# EAGLE design mainboard (EAGLE 9.6.2)
CNAME: Line Follower; CREVISION: 1
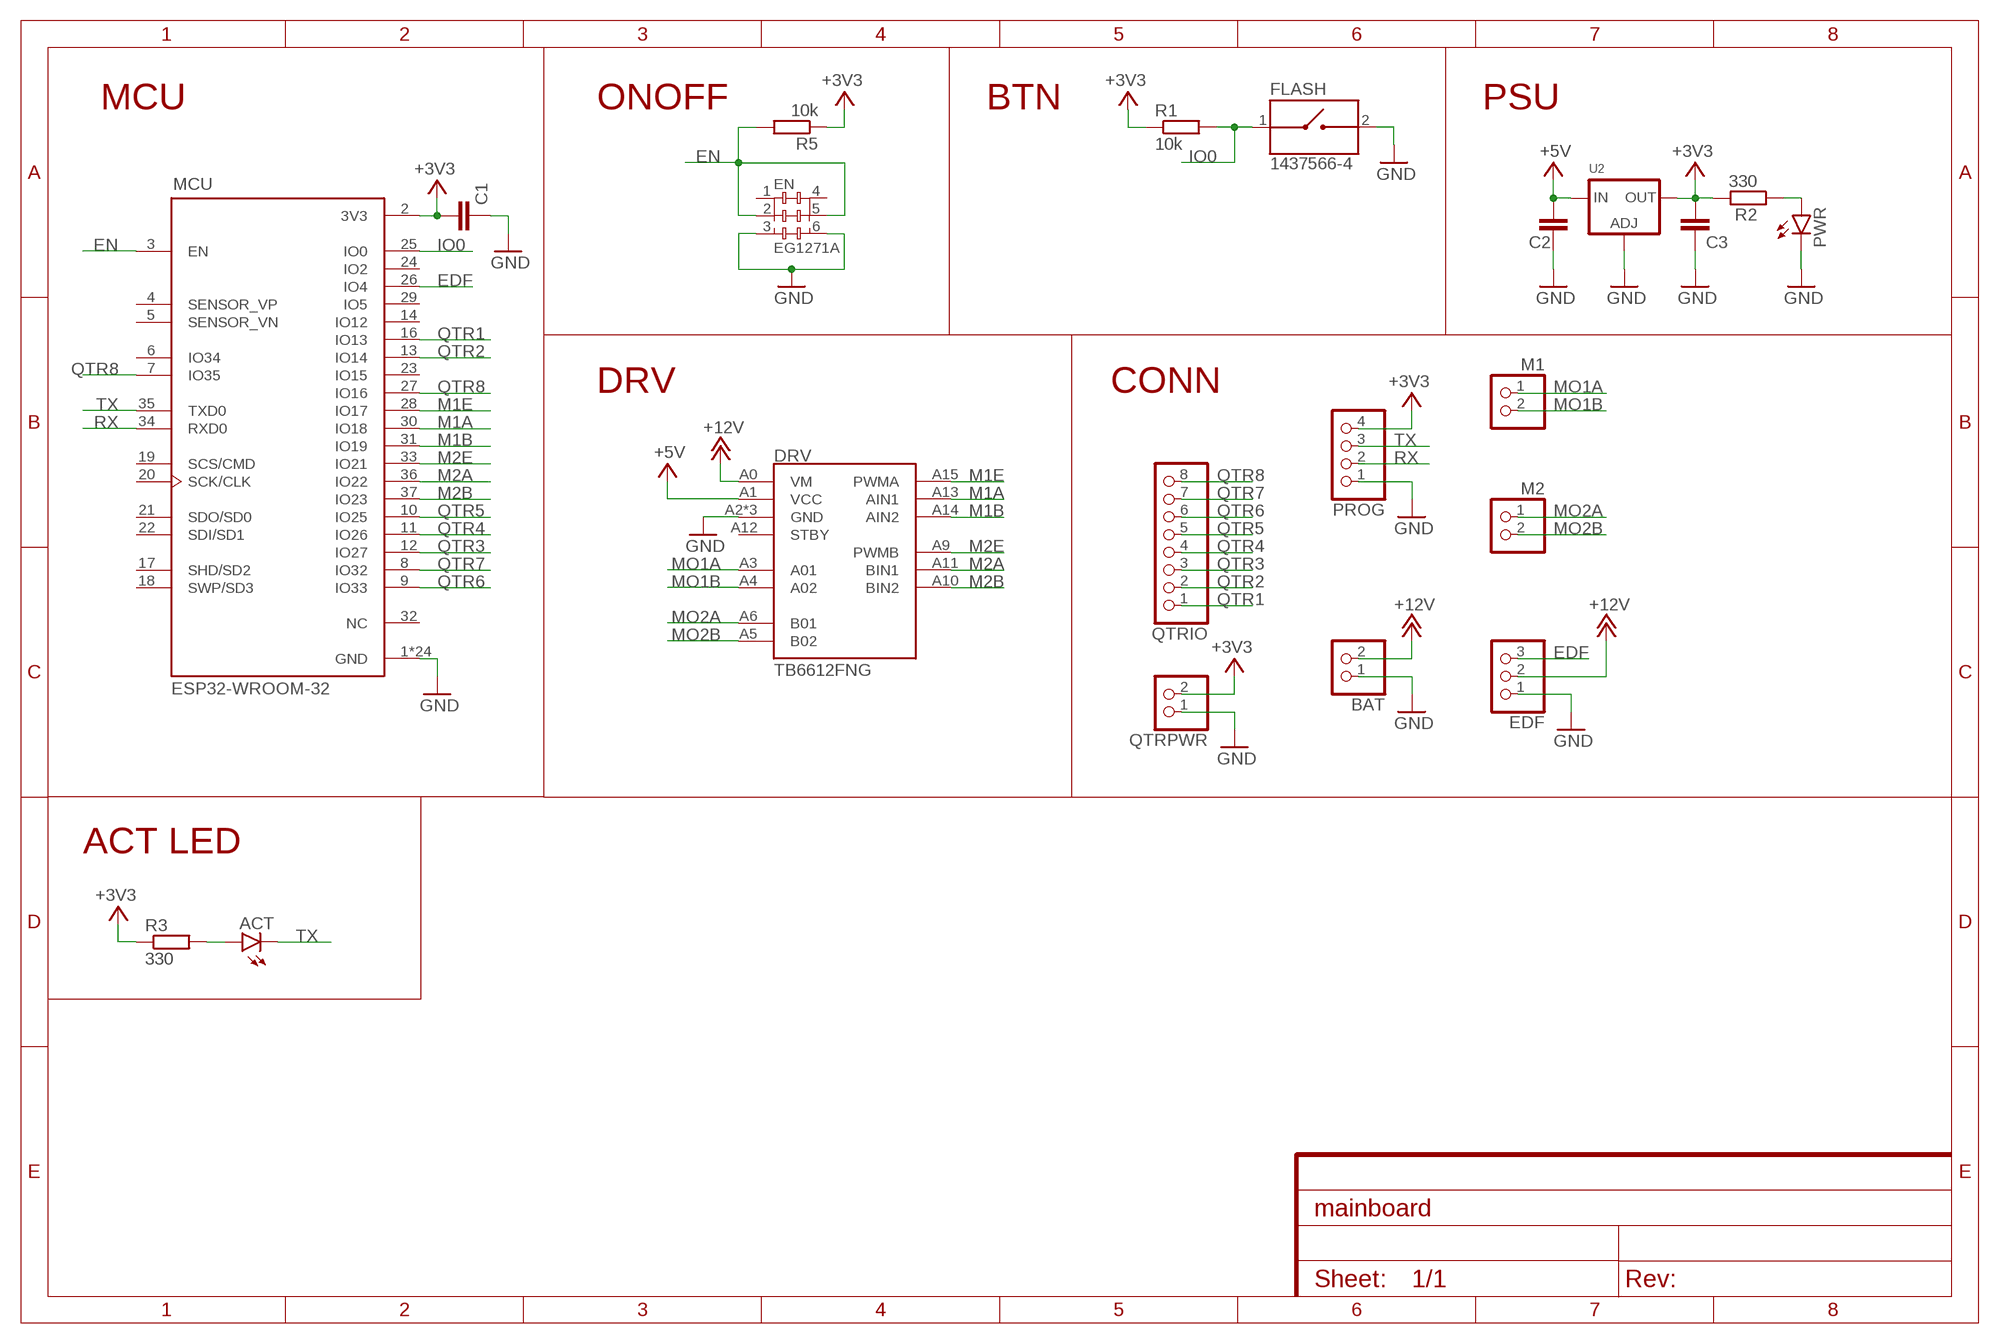
[diagram p0: schematic, sheet 1]

## Parts
ACT  LEDCHIPLED_0805  [CHIPLED_0805]
BAT  PINHD-1X2  [1X02]
C1  C-EUC0805  [C0805]
C2  C-EUC0805  [C0805]
C3  C-EUC0805  [C0805]
DRV  TB6612FNG  [TB6612FNG]
EDF  PINHD-1X3  [1X03]
EN  EG1271A  [SW_EG1271A]
FLASH  1437566-4  [SW_1437566-4]
M1  PINHD-1X2  [1X02]
M2  PINHD-1X2  [1X02]
MCU  ESP32-WROOM-32  [MODULE_ESP32-WROOM-32]
PROG  PINHD-1X4  [1X04]
PWR  LEDCHIPLED_0805  [CHIPLED_0805]
QTRIO  PINHD-1X8  [1X08]
QTRPWR  PINHD-1X2  [1X02]
R1  10k  R-EU_R0603  [R0603]
R2  330  R-EU_R0603  [R0603]
R3  330  R-EU_R0603  [R0603]
R5  10k  R-EU_R0603  [R0603]
U2  LM1117SOT223-WAVE  [SOT223-W]

## Nets
+3V3: C1.1 C3.1 MCU.2(3V3) PROG.4 QTRPWR.2 R1.1 R2.2 R3.1 R5.1 U2.2(OUT)
+5V: C2.1 DRV.A1(VCC) U2.3(IN)
+12V [pwr]: BAT.2 DRV.A0(VM) EDF.2
EDF: EDF.3 MCU.26(IO4)
EN: EN.2 EN.5 MCU.3(EN) R5.2
GND [pwr]: BAT.1 C1.2 C2.2 C3.2 DRV.A2(GND) DRV.A7(GND) DRV.A8(GND) EDF.1 EN.3 EN.6 FLASH.2 MCU.1(GND) MCU.15(GND) MCU.38(GND) MCU.39_1(GND) MCU.39_2(GND) MCU.39_3(GND) MCU.39_4(GND) MCU.39_5(GND) MCU.39_6(GND) MCU.39_7(GND) MCU.39_8(GND) MCU.39_9(GND) MCU.39_10(GND) MCU.39_11(GND) MCU.39_12(GND) MCU.39_13(GND) MCU.39_14(GND) MCU.39_15(GND) MCU.39_16(GND) MCU.39_17(GND) MCU.39_18(GND) MCU.39_19(GND) MCU.39_20(GND) MCU.39_21(GND) PROG.1 PWR.C QTRPWR.1 U2.1(ADJ)
IO0: FLASH.1 MCU.25(IO0) R1.2
M1A: DRV.A13(AIN1) MCU.30(IO18)
M1B: DRV.A14(AIN2) MCU.31(IO19)
M1E: DRV.A15(PWMA) MCU.28(IO17)
M2A: DRV.A11(BIN1) MCU.36(IO22)
M2B: DRV.A10(BIN2) MCU.37(IO23)
M2E: DRV.A9(PWMB) MCU.33(IO21)
MO1A [pwr]: DRV.A3(A01) M1.1
MO1B [pwr]: DRV.A4(A02) M1.2
MO2A [pwr]: DRV.A6(B01) M2.1
MO2B [pwr]: DRV.A5(B02) M2.2
N$1: PWR.A R2.1
N$2: ACT.A R3.2
QTR1: MCU.16(IO13) QTRIO.1
QTR2: MCU.13(IO14) QTRIO.2
QTR3: MCU.12(IO27) QTRIO.3
QTR4: MCU.11(IO26) QTRIO.4
QTR5: MCU.10(IO25) QTRIO.5
QTR6: MCU.9(IO33) QTRIO.6
QTR7: MCU.8(IO32) QTRIO.7
QTR8: MCU.7(IO35) MCU.27(IO16) QTRIO.8
RX: MCU.34(RXD0) PROG.2
TX: ACT.C MCU.35(TXD0) PROG.3
Unconnected: DRV.A12(STBY) EN.1 EN.4 MCU.4(SENSOR_VP) MCU.5(SENSOR_VN) MCU.6(IO34) MCU.14(IO12) MCU.17(SHD/SD2) MCU.18(SWP/SD3) MCU.19(SCS/CMD) MCU.20(SCK/CLK) MCU.21(SDO/SD0) MCU.22(SDI/SD1) MCU.23(IO15) MCU.24(IO2) MCU.29(IO5) MCU.32(NC)

## Notes on the sheet
- MCU | ONOFF | BTN | PSU
- DRV | CONN
- ACT LED

## Library data of the parts
ACT PWR = led:LED: LED OSRAM: - CHIPLED LG R971, LG N971, LY N971, LG Q971, LY Q971, LO R971, LY R971 LH N974, LH R974 LS Q976, LO Q976, LY Q976 LO Q996 - Hyper CHIPLED LW Q18S LB Q993, LB Q99A, LB R99A - SideLED LS A670, LO A670, LY A670, LG A670, LP A670 LB A673, LV A673, LT A673, LW A673 LH A674 LY A675 LS A676, LA A676, LO A676, LY A676, LW A676 LS A679, LY A679, LG A679 - Hyper Micro SIDELED® LS Y876, LA Y876, LO Y876, LY Y876 LT Y87S - SmartLED LW L88C, LW L88S LB L89C, LB L89S, LG L890 LS L89K, LO L89K, LY L89K LS L896, LA L896, LO L896, LY L896 - TOPLED LS T670, LO T670, LY T670, LG T670, LP T670 LSG T670, LSP T670, LSY T670, LOP T670, LYG T670 LG T671, LOG T671, LSG T671 LB T673, LV T673, LT T673, LW T673 LH T674 LS T676, LA T676, LO T676, LY T676, LB T676, LH T676, LSB T676, LW T676 LB T67C, LV T67C, LT T67C, LS T67K, LO T67K, LY T67K, LW E67C LS E67B, LA E67B, LO E67B, LY E67B, LB E67C, LV E67C, LT E67C LW T67C LS T679, LY T679, LG T679 LS T770, LO T770, LY T770, LG T770, LP T770 LB T773, LV T773, LT T773, LW T773 LH T774 LS E675, LA E675, LY E675, LS T675 LS T776, LA T776, LO T776, LY T776, LB T776 LHGB T686 LT T68C, LB T68C - Hyper Mini TOPLED® LB M676 - Mini TOPLED Santana® LG M470 LS M47K, LO M47K, LY M47K Source: http://www.osram.convergy.de LUXEON: - LUMILED® LXK2-PW12-R00, LXK2-PW12-S00, LXK2-PW14-U00, LXK2-PW14-V00 LXK2-PM12-R00, LXK2-PM12-S00, LXK2-PM14-U00 LXK2-PE12-Q00, LXK2-PE12-R00, LXK2-PE12-S00, LXK2-PE14-T00, LXK2-PE14-U00 LXK2-PB12-K00, LXK2-PB12-L00, LXK2-PB12-M00, LXK2-PB14-N00, LXK2-PB14-P00, LXK2-PB14-Q00 LXK2-PR12-L00, LXK2-PR12-M00, LXK2-PR14-Q00, LXK2-PR14-R00 LXK2-PD12-Q00, LXK2-PD12-R00, LXK2-PD12-S00 LXK2-PH12-R00, LXK2-PH12-S00 LXK2-PL12-P00, LXK2-PL12-Q00, LXK2-PL12-R00 Source: www.luxeon.com KINGBRIGHT: KA-3528ASYC Source: www.kingbright.com
BAT M1 M2 QTRPWR = pinhead:PINHD-1X2: PIN HEADER
C1-C3 = rcl:C-EU: CAPACITOR, European symbol; SPICEPREFIX: C
DRV = TB6612FNG:TB6612FNG
EDF = pinhead:PINHD-1X3: PIN HEADER
EN = EG1271A:EG1271A: Slide Switch SPDT Through Hole Check availability <https://pricing.snapeda.com/parts/EG1271A/E-Switch/view-part?ref=eda>; AVAILABILITY: In Stock; DESCRIPTION: Slide Switch SPDT Through Hole; MF: E-Switch; MP: EG1271A; PACKAGE: None; PRICE: None; PURCHASE-URL: https://pricing.snapeda.com/search/part/EG1271A/?ref=eda
FLASH = 1437566-4:1437566-4: SWITCH TACTILE SPST-NO 0.05A 24V Check availability <https://pricing.snapeda.com/parts/1437566-4/TE%20Connectivity/view-part?ref=eda>; AVAILABILITY: In Stock; COMMENT: 1437566-4; DESCRIPTION: Tactile Switch SPST-NO Top Actuated Surface Mount; MF: TE Connectivity; MP: 1437566-4; PACKAGE: None; PRICE: None
MCU = ESP32-WROOM-32:ESP32-WROOM-32: Check availability <https://pricing.snapeda.com/parts/ESP32-WROOM-32/Espressif%20Systems/view-part?ref=eda>; AVAILABILITY: In Stock; DESCRIPTION: Bluetooth, WiFi 802.11b/g/n, Bluetooth v4.2 +EDR, Class 1, 2 and 3 Transceiver Module 2.4GHz ~ 2.5GHz Antenna Not Included, U.FL Surface Mount; MF: Espressif Systems; MP: ESP32-WROOM-32; PACKAGE: Module Espressif Systems; PRICE: None; PURCHASE-URL: https://pricing.snapeda.com/search/part/ESP32-WROOM-32/?ref=eda
PROG = pinhead:PINHD-1X4: PIN HEADER
QTRIO = pinhead:PINHD-1X8: PIN HEADER
R1-R3 R5 = rcl:R-EU_: RESISTOR, European symbol; SPICEPREFIX: R
U2 = microbuilder:LM1117: LM1117 Voltage Regulator LM1117 Adjustable Voltage regulator [Digikey: LM1117IMP-ADJDKR-ND] LM1117 3.3V Voltage regulator [AP1117E33GDIDKR-ND] LM1117 5.0V Voltage regulator [AP1117E50GDIDKR-ND] SOT223-REFLOW - SOT223 package for solder paste/reflow ovens SOT223-WAVE - SOT223 package for hand-soldering (larger pads) Note: For the fixed-voltage regulators, simply set the ADJ pin to GND.

## Net classes
0 default: width 0.305 mm, clearance 0.254 mm
1 pwr: width 0.457 mm, clearance 0.254 mm

## Board
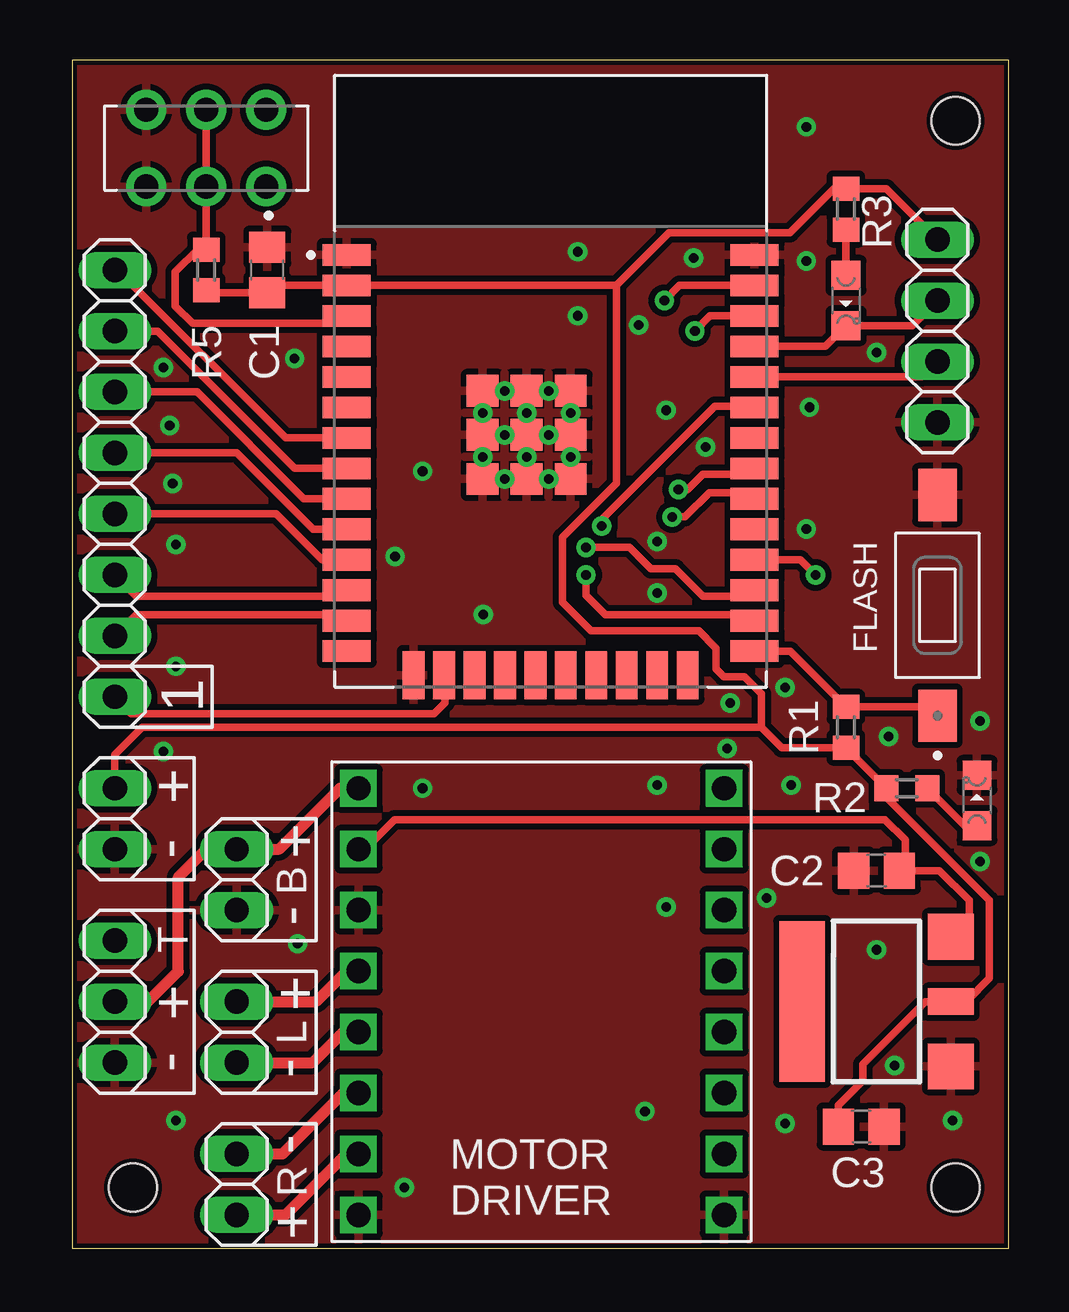
[diagram p1: board, top side]
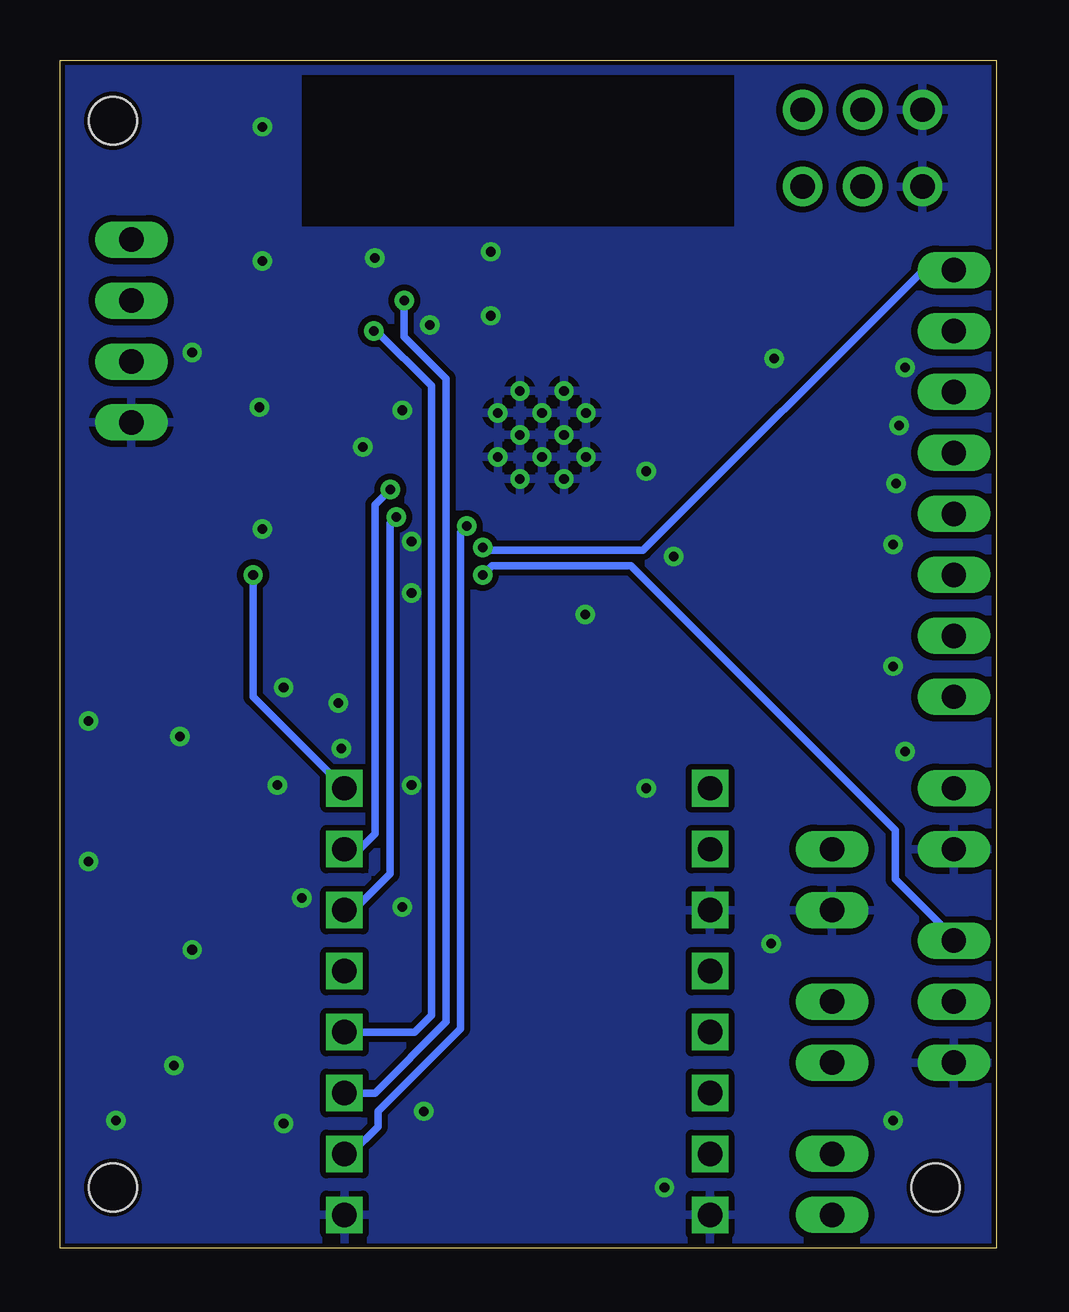
[diagram p2: board, bottom side, seen from below]

Size 39.04 x 49.52 mm. Coordinates in mm from the lower left corner, seen from the top.
Outline: 0,0 39.04,0 39.04,49.52 0,49.52 0,0
Copper layers (1*16): Top 0.035mm / dielectric 1.5mm / Bottom 0.035mm
Design rules "satland *": minimum track width 10mil, minimum drill 0.4mm, track to track 8mil, track to pad 8mil, pad to pad 8mil, via to via 8mil, smd to smd 8mil, copper to edge 0.2mm, drill to drill 0.3mm, minimum pad ring 8mil, minimum via ring 8mil, stop-mask expansion 4mil, vias tented up to drill 0.4mm, thermal gap 10mil
Holes 2 mm at 2.54,2.54 36.83,2.54 36.83,46.99

### Footprints (pad centres in the part's own frame; a part is rotated, then mirrored left to right if it is on the bottom)
CHIPLED_0805 = smd 1.2 x 1.2: A 0,-1.05; C 0,1.05
1X02 = drill 1.016 long: 1 -1.27,0; 2 1.27,0
C0805 = smd 1.3 x 1.5: 1 -0.95,0; 2 0.95,0
TB6612FNG = drill 1.016 square: A0 -7.62,8.89; A1 -7.62,6.35; A2 -7.62,3.81; A3 -7.62,1.27; A4 -7.62,-1.27; A5 -7.62,-3.81; A6 -7.62,-6.35; A7 -7.62,-8.89; A8 7.62,-8.89; A9 7.62,-6.35; A10 7.62,-3.81; A11 7.62,-1.27; A12 7.62,1.27; A13 7.62,3.81; A14 7.62,6.35; A15 7.62,8.89
1X03 = drill 1.016 long: 1 -2.54,0; 2 0,0; 3 2.54,0
SW_EG1271A = drill 1.016 pad 1.651: 1 -2.5,1.6; 2 0,1.6; 3 2.5,1.6; 4 -2.5,-1.6; 5 0,-1.6; 6 2.5,-1.6
SW_1437566-4 = smd 2.18 x 1.6: 1 -4.6,0; 2 4.6,0
MODULE_ESP32-WROOM-32 = smd 2 x 0.9: 1 -8.5,5.26; 2 -8.5,3.99; 3 -8.5,2.72; 4 -8.5,1.45; 5 -8.5,0.18; 6 -8.5,-1.09; 7 -8.5,-2.36; 8 -8.5,-3.63; 9 -8.5,-4.9; 10 -8.5,-6.17; 11 -8.5,-7.44; 12 -8.5,-8.71; 13 -8.5,-9.98; 14 -8.5,-11.25; 25 8.5,-11.25; 26 8.5,-9.98; 27 8.5,-8.71; 28 8.5,-7.44; 29 8.5,-6.17; 30 8.5,-4.9; 31 8.5,-3.63; 32 8.5,-2.36; 33 8.5,-1.09; 34 8.5,0.18; 35 8.5,1.45; 36 8.5,2.72; 37 8.5,3.99; 38 8.5,5.26 | smd 0.9 x 2: 15 -5.715,-12.25; 16 -4.445,-12.25; 17 -3.175,-12.25; 18 -1.905,-12.25; 19 -0.635,-12.25; 20 0.635,-12.25; 21 1.905,-12.25; 22 3.175,-12.25; 23 4.445,-12.25; 24 5.715,-12.25 | smd 1.33 x 1.33: 39_1 -2.835,-0.405; 39_2 -1,-0.405; 39_3 0.835,-0.405; 39_4 -2.835,-2.24; 39_5 -1,-2.24; 39_6 0.835,-2.24; 39_7 -2.835,-4.075; 39_8 -1,-4.075; 39_9 0.835,-4.075 | drill 0.4 pad 0.6: 39_10 -1.917,-0.405; 39_11 -0.083,-0.405; 39_12 -2.835,-1.323; 39_13 -1,-1.323; 39_14 0.835,-1.323; 39_15 -1.917,-2.24; 39_16 -0.083,-2.24; 39_17 -2.835,-3.158; 39_18 -1,-3.158; 39_19 0.835,-3.158; 39_20 -1.917,-4.075; 39_21 -0.083,-4.075
1X04 = drill 1.016 long: 1 -3.81,0; 2 -1.27,0; 3 1.27,0; 4 3.81,0
1X08 = drill 1.016 long: 1 -8.89,0; 2 -6.35,0; 3 -3.81,0; 4 -1.27,0; 5 1.27,0; 6 3.81,0; 7 6.35,0; 8 8.89,0
R0603 = smd 1 x 1.1: 1 -0.85,0; 2 0.85,0
SOT223-W = smd 1.9 x 1.9: 1 -2.7,-3.1; 3 2.7,-3.1 | smd 1.1 x 1.9: 2 0,-3.1 | smd 6.7 x 1.9: 4 0,3.1

### Placement (x,y rotation side)
ACT  32.26,39.5 180 top
BAT  6.86,15.37 90 top
C1  8.13,40.77 90 top
C2  33.53,15.75 180 top
C3  32.89,5.08 0 top
DRV  19.56,10.29 0 top
EDF  1.78,10.29 90 top
EN  5.59,45.85 180 top
FLASH  36.07,26.8 90 top
M1  6.86,9.02 270 top
M2  6.86,2.67 90 top
MCU  19.95,36.14 0 top
PROG  36.07,38.23 90 top
PWR  37.72,18.67 0 top
QTRIO  1.78,31.88 90 top
QTRPWR  1.78,17.91 90 top
R1  32.26,21.72 90 top
R2  34.8,19.18 180 top
R3  32.26,43.31 270 top
R5  5.59,40.77 90 top
U2  33.53,10.29 90 top

### Tracks (layer width: path | path; a pad name or v marks a point on that pad's centre or on a via)
+3V3
  Top 0.305: R5.1 5.69,39.82 C1.1 8.44,40.13 MCU.2 22.68,40.13 | PROG.4 33.95,44.16 R3.1 31.75,44.16 29.92,42.33 24.89,42.33 22.68,40.13 | C3.1 31.94,5.97 32.96,6.99 32.96,7.69 35.56,10.29 U2.2 37.26,10.29 38.23,11.25 38.23,14.52 33.95,18.8 R2.2 R1.1 29.59,20.87 28.74,21.72 | 22.68,40.13 22.68,31.88 20.45,29.64 20.45,26.92 21.63,25.74 26.12,25.74 26.84,25.02 26.84,24.16 27.17,23.83 28.03,23.83 28.74,23.11 28.74,21.72 | 28.74,21.72 2.92,21.72 1.78,20.57 QTRPWR.2
+5V
  Top 0.305: U2.3 37.39,13.75 37.39,14.51 36.15,15.75 C2.1 34.73,16 34.73,17.02 33.88,17.87 13.44,17.87 12.21,16.64 DRV.A1
+12V
  Top 0.457: DRV.A0 11.18,19.18 8.64,16.64 BAT.2 5.59,16.64 4.42,15.47 4.42,11.55 3.16,10.29 EDF.2
EDF  (via drill 0.4)
  Top 0.305: MCU.26 28.19,26.41 22.23,26.41 21.42,27.22 v21.42,28.07
  Bottom 0.305: v21.42,28.07 21.04,28.45 15.24,28.45 4.22,17.42 4.22,15.39 1.78,12.95 EDF.3
EN
  Top 0.305: EN.5 EN.2 R5.2 5.23,41.62 4.3,40.69 4.3,39.27 5.01,38.56 11.15,38.56 MCU.3
GND  (via drill 0.4)
  other vias: 4.32,5.33 9.4,12.7 3.81,20.7 4.32,24.26 14.61,19.18 17.14,26.42 13.46,28.83 14.61,32.38 4.32,29.34 4.19,31.88 4.06,34.29 3.81,36.7 21.08,41.53 21.08,38.86 23.62,38.48 25.91,41.27 24.77,34.92 26.42,33.4 30.73,35.05 30.61,41.15 30.61,46.74 33.53,37.34 30.61,29.97 24.38,29.46 24.38,27.3 24.38,19.3 27.43,22.73 29.97,19.3 27.3,20.83 34.04,21.34 37.85,21.97 28.96,14.61 33.53,12.45 34.29,7.62 36.7,5.33 29.72,5.21 23.88,5.71 24.77,14.22 13.84,2.54 37.85,16.13 29.72,23.37 9.27,37.08
  pour Top: -55.88,133.35 181.61,133.35 181.61,-63.5 -55.88,-63.5
  pour Bottom: -58.42,135.89 184.15,135.89 184.15,-67.31 -58.42,-67.31
IO0
  Top 0.305: MCU.25 29.94,24.89 R1.2 35.7,22.57 FLASH.1
M1A  (via drill 0.4)
  Top 0.305: MCU.30 28.19,31.49 26.56,31.49 25.55,30.48 v25.02,30.48
  Bottom 0.305: DRV.A13 26.8,14.1 25.27,15.62 25.27,30.23 v25.02,30.48
M1B  (via drill 0.4)
  Top 0.305: v25.27,31.62 25.65,31.62 26.28,32.25 28.19,32.25 MCU.31
  Bottom 0.305: DRV.A14 26.54,16.64 25.91,17.27 25.91,30.99 v25.27,31.62
M1E  (via drill 0.4)
  Top 0.305: MCU.28 30.36,28.7 v30.99,28.07
  Bottom 0.305: DRV.A15 30.99,22.99 v30.99,28.07
M2A  (via drill 0.4)
  Top 0.305: v25.96,38.23 26.59,38.86 MCU.36
  Bottom 0.305: DRV.A11 24.26,9.02 23.55,9.73 23.55,35.94 25.83,38.23 v25.96,38.23
M2B  (via drill 0.4)
  Top 0.305: MCU.37 25.32,40.13 v24.69,39.5
  Bottom 0.305: v24.69,39.5 24.69,37.99 22.94,36.24 22.94,9.45 25.91,6.48 DRV.A10
M2E  (via drill 0.4)
  Top 0.305: MCU.33 28.4,35.09 26.79,35.09 22.08,30.38 v22.08,30.1
  Bottom 0.305: DRV.A9 26.92,3.94 25.78,5.08 25.78,5.71 22.33,9.16 22.33,29.84 v22.08,30.1
MO1A
  Top 0.457: M1.1 10.16,10.29 11.43,11.56 DRV.A3
MO1B
  Top 0.457: M1.2 10.03,7.75 11.3,9.02 DRV.A4
MO2A
  Top 0.457: M2.1 8.89,1.4 11.43,3.94 DRV.A6
MO2B
  Top 0.457: M2.2 8.76,3.94 11.3,6.48 DRV.A5
N$1
  Top 0.305: R2.1 37.21,17.62 PWR.A
N$2
  Top 0.305: R3.2 ACT.A
QTR1
  Top 0.305: MCU.16 15.55,23.84 15.55,22.74 15.08,22.28 2.46,22.28 1.78,22.96 QTRIO.1
QTR2
  Top 0.305: MCU.13 11.19,26.41 2.66,26.41 QTRIO.2
QTR3
  Top 0.305: MCU.12 11.19,27.17 2.67,27.17 QTRIO.3
QTR4
  Top 0.305: MCU.11 10.42,28.7 8.51,30.61 QTRIO.4
QTR5
  Top 0.305: MCU.10 10.04,29.97 6.86,33.15 QTRIO.5
QTR6
  Top 0.305: MCU.9 9.66,31.24 5.21,35.69 QTRIO.6
QTR7
  Top 0.305: QTRIO.7 3.56,38.23 9.28,32.51 MCU.8
QTR8  (via drill 0.4)
  Top 0.305: QTRIO.8 1.91,40.77 8.89,33.78 MCU.7 | MCU.27 28.19,27.17 26.29,27.17 25.15,28.32 24.13,28.32 23.24,29.21 v21.42,29.21
  Bottom 0.305: QTRIO.8 3.05,40.77 14.73,29.08 21.29,29.08 v21.42,29.21
RX
  Top 0.305: MCU.34 35.43,36.32 PROG.2
TX
  Top 0.305: MCU.35 31.4,37.59 ACT.C 35.02,38.45 PROG.3

### Text on the board
tNames: 1 | + | + | - | B | - | T | + | + | L | - | - | - | R | +